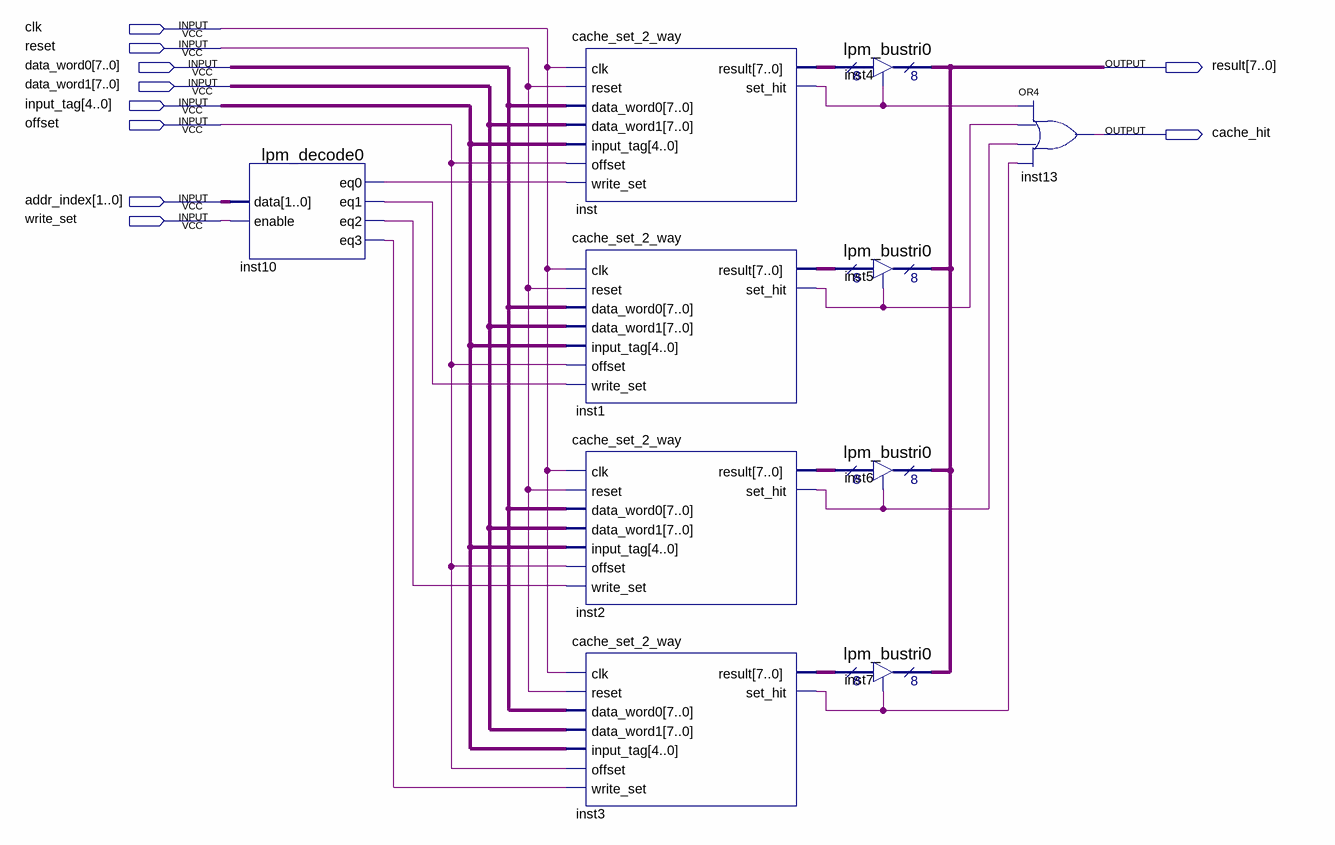
[diagram p0: schematic sheet]
// Quartus schematic cache_top_level.bdf as structural Verilog: 10 symbols, 10 pins
module cache_top_level (
  input  clk,
  input  reset,
  input  [7:0] data_word0,
  input  [7:0] data_word1,
  input  [4:0] input_tag,
  input  offset,
  input  [1:0] addr_index,
  input  write_set,
  output [7:0] result,
  output cache_hit
);

  wire inst1_set_hit, inst2_set_hit, inst3_set_hit, inst10_eq0, inst10_eq1, inst10_eq2, inst10_eq3,
       inst_set_hit;
  wire [7:0] inst1_result, inst2_result, inst3_result, inst_result;

  lpm_decode0 inst10 (
    .data(addr_index), .enable(write_set), .eq0(inst10_eq0), .eq1(inst10_eq1), .eq2(inst10_eq2),
    .eq3(inst10_eq3));
  cache_set_2_way inst (
    .clk(clk), .reset(reset), .data_word0(data_word0), .data_word1(data_word1), .input_tag(input_tag),
    .offset(offset), .write_set(inst10_eq0), .result(inst_result), .set_hit(inst_set_hit));
  cache_set_2_way inst1 (
    .clk(clk), .reset(reset), .data_word0(data_word0), .data_word1(data_word1), .input_tag(input_tag),
    .offset(offset), .write_set(inst10_eq1), .result(inst1_result), .set_hit(inst1_set_hit));
  cache_set_2_way inst2 (
    .clk(clk), .reset(reset), .data_word0(data_word0), .data_word1(data_word1), .input_tag(input_tag),
    .offset(offset), .write_set(inst10_eq2), .result(inst2_result), .set_hit(inst2_set_hit));
  cache_set_2_way inst3 (
    .clk(clk), .reset(reset), .data_word0(data_word0), .data_word1(data_word1), .input_tag(input_tag),
    .offset(offset), .write_set(inst10_eq3), .result(inst3_result), .set_hit(inst3_set_hit));
  lpm_bustri0 inst4 (.enabledt(inst_set_hit), .data(inst_result), .tridata(result));
  lpm_bustri0 inst5 (.enabledt(inst1_set_hit), .data(inst1_result), .tridata(result));
  lpm_bustri0 inst6 (.enabledt(inst2_set_hit), .data(inst2_result), .tridata(result));
  lpm_bustri0 inst7 (.enabledt(inst3_set_hit), .data(inst3_result), .tridata(result));
  or inst13 (cache_hit, inst_set_hit, inst1_set_hit, inst2_set_hit, inst3_set_hit);
endmodule
